# EAGLE board MEM_MUX_3 (EAGLE 6.5.0), part 1 of 2
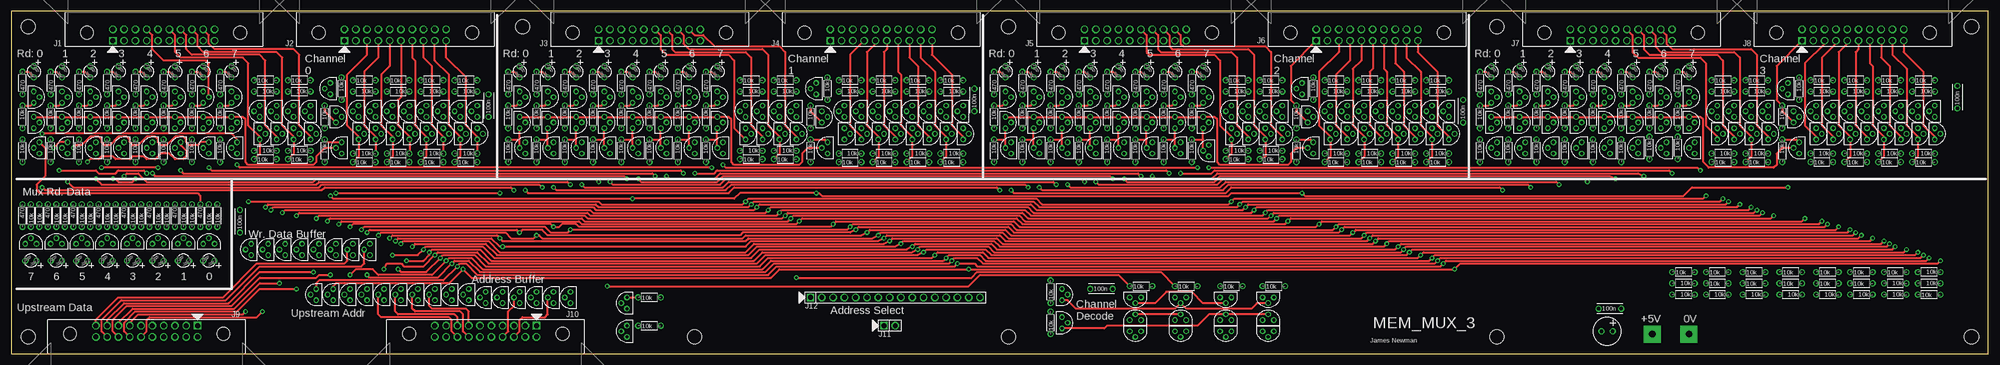
[diagram p18: board, top side]
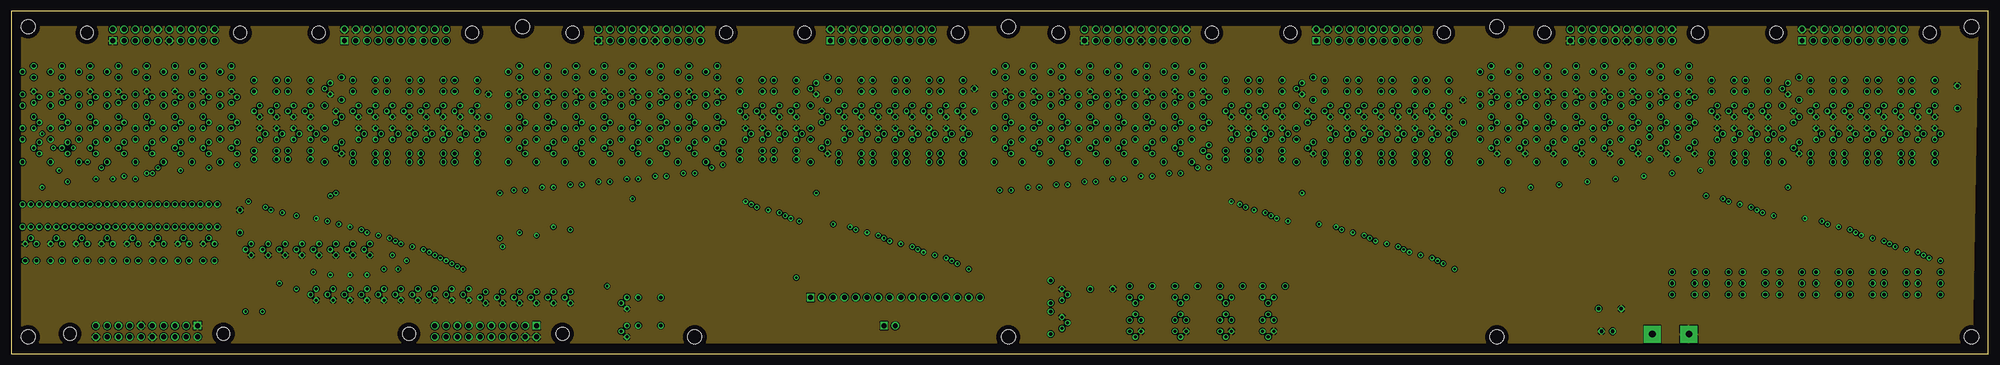
[diagram p19: board, inner layer Route2]
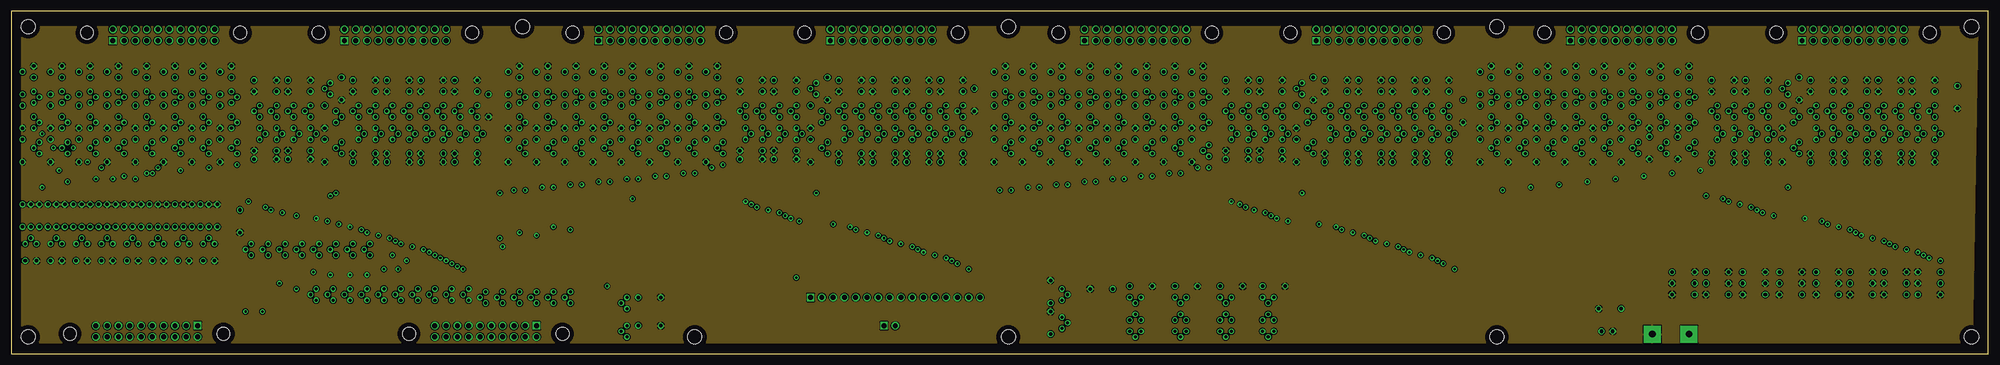
[diagram p20: board, inner layer Route3]
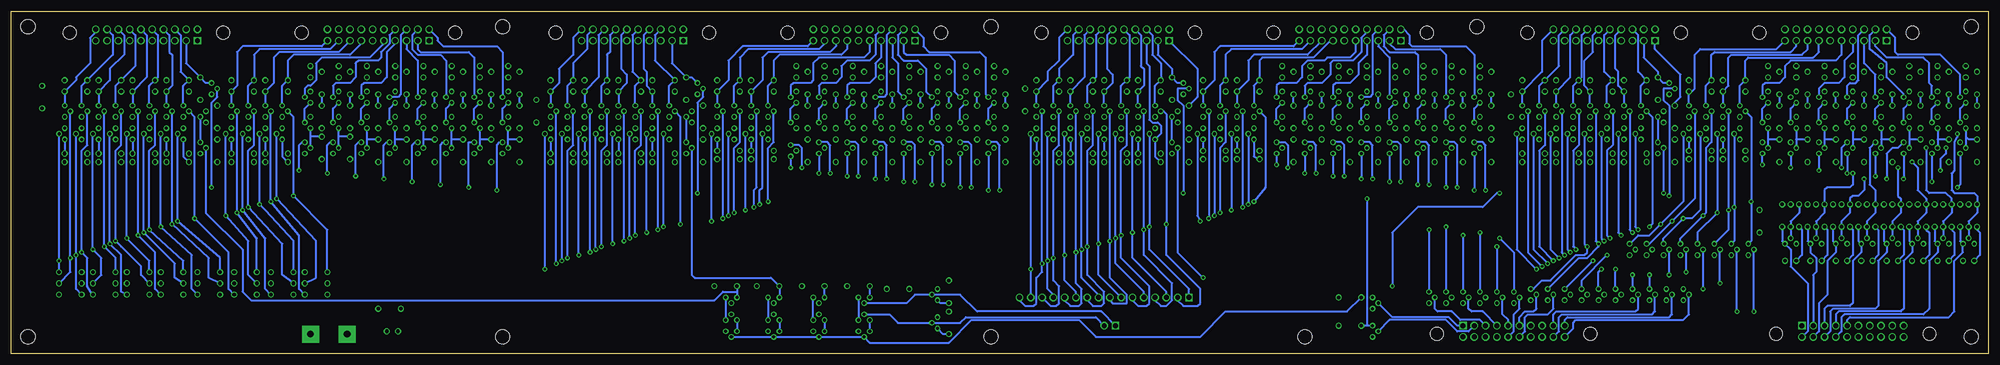
[diagram p21: board, bottom side, seen from below]

Size 444.48 x 77.14 mm. Coordinates in mm from the lower left corner, seen from the top.
Outline: 0,0 444.48,0 444.48,77.14 0,77.14 0,0
Copper layers (1*2+3*16): Top 0.035mm / dielectric 0.2mm / Route2 0.035mm / dielectric 1mm / Route3 0.035mm / dielectric 0.2mm / Bottom 0.035mm
Design rules "processor_rules_4layer": minimum track width 10mil, minimum drill 0.0236mm, track to track 8mil, track to pad 8mil, pad to pad 8mil, via to via 8mil, smd to smd 8mil, copper to edge 40mil, drill to drill 8mil, minimum pad ring 10mil, minimum via ring 8mil, stop-mask expansion 4mil, vias tented up to drill 0.7mm, thermal gap 10mil

## Footprints (pad centres in the part's own frame; a part is rotated, then mirrored left to right if it is on the bottom)
CAP_P2INCH = drill 0.8: 1 -2.54,0; 2 2.54,0
POLARISED_CAP_2P5_6P3MM = drill 0.8: A 1.27,0; K -1.27,0
LED3MM = drill 0.8: A -1.27,0; K 1.27,0
3M_HOLE = hole 3.2: 0,0
20_HDR_LOCKING_RA = drill 1.1 square: 1 -11.43,-1.27 | drill 1.1: 2 -11.43,1.27; 3 -8.89,-1.27; 4 -8.89,1.27; 5 -6.35,-1.27; 6 -6.35,1.27; 7 -3.81,-1.27; 8 -3.81,1.27; 9 -1.27,-1.27; 10 -1.27,1.27; 11 1.27,-1.27; 12 1.27,1.27; 13 3.81,-1.27; 14 3.81,1.27; 15 6.35,-1.27; 16 6.35,1.27; 17 8.89,-1.27; 18 8.89,1.27; 19 11.43,-1.27; 20 11.43,1.27 | hole 2.946: -17.247,0.533; 17.247,0.533
JUMP_2X1 = drill 1.1 square: 1 -1.27,0 | drill 1.1: 2 1.27,0
JUMP_16X1 = drill 1.1 square: 1 -19.05,0 | drill 1.1: 2 -16.51,0; 3 -13.97,0; 4 -11.43,0; 5 -8.89,0; 6 -6.35,0; 7 -3.81,0; 8 -1.27,0; 9 1.27,0; 10 3.81,0; 11 6.35,0; 12 8.89,0; 13 11.43,0; 14 13.97,0; 15 16.51,0; 16 19.05,0
TO92-DGS = drill 0.7: D 0,1.27; G -1.27,0; S 0,-1.27
R_P2INCH = drill 0.8: 1 -2.54,0; 2 2.54,0
POWER_PAD = drill 1.5 pad 3.81 square: 1 0,0

## Placement (x,y rotation side)
C1  100n  [CAP_P2INCH]  216.53,57.15 90 top
C2  100n  [CAP_P2INCH]  51.44,29.84 90 top
C3  100n  [CAP_P2INCH]  107.31,55.88 90 top
C4  100n  [CAP_P2INCH]  359.41,10.16 0 top
C5  100n  [CAP_P2INCH]  245.11,14.61 0 top
C6  100n  [CAP_P2INCH]  437.51,57.78 90 top
C7  100u  [POLARISED_CAP_2P5_6P3MM]  358.77,5.08 0 top
C8  100n  [CAP_P2INCH]  326.39,54.61 90 top
D1  L-1334SRT  [LED3MM]  5.08,63.5 270 top
D2  L-1334SRT  [LED3MM]  11.43,63.5 270 top
D3  L-1334SRT  [LED3MM]  17.78,63.5 270 top
D4  L-1334SRT  [LED3MM]  24.13,63.5 270 top
D5  L-1334SRT  [LED3MM]  30.48,63.5 270 top
D6  L-1334SRT  [LED3MM]  36.83,63.5 270 top
D7  L-1334SRT  [LED3MM]  43.18,63.5 270 top
D8  L-1334SRT  [LED3MM]  49.53,63.5 270 top
D9  L-1334SRT  [LED3MM]  114.3,63.5 270 top
D10  L-1334SRT  [LED3MM]  120.65,63.5 270 top
D11  L-1334SRT  [LED3MM]  127,63.5 270 top
D12  L-1334SRT  [LED3MM]  133.35,63.5 270 top
D13  L-1334SRT  [LED3MM]  139.7,63.5 270 top
D14  L-1334SRT  [LED3MM]  146.05,63.5 270 top
D15  L-1334SRT  [LED3MM]  152.4,63.5 270 top
D16  L-1334SRT  [LED3MM]  158.75,63.5 270 top
D17  L-1334SRT  [LED3MM]  223.52,63.5 270 top
D18  L-1334SRT  [LED3MM]  229.87,63.5 270 top
D19  L-1334SRT  [LED3MM]  236.22,63.5 270 top
D20  L-1334SRT  [LED3MM]  242.57,63.5 270 top
D21  L-1334SRT  [LED3MM]  248.92,63.5 270 top
D22  L-1334SRT  [LED3MM]  255.27,63.5 270 top
D23  L-1334SRT  [LED3MM]  261.62,63.5 270 top
D24  L-1334SRT  [LED3MM]  267.97,63.5 270 top
D25  L-1334SRT  [LED3MM]  332.74,63.5 270 top
D26  L-1334SRT  [LED3MM]  339.09,63.5 270 top
D27  L-1334SRT  [LED3MM]  345.44,63.5 270 top
D28  L-1334SRT  [LED3MM]  351.79,63.5 270 top
D29  L-1334SRT  [LED3MM]  358.14,63.5 270 top
D30  L-1334SRT  [LED3MM]  364.49,63.5 270 top
D31  L-1334SRT  [LED3MM]  370.84,63.5 270 top
D32  L-1334SRT  [LED3MM]  377.19,63.5 270 top
D33  L-1334SRT  [LED3MM]  38.73,20.95 180 top
D34  L-1334SRT  [LED3MM]  33.02,20.95 180 top
D35  L-1334SRT  [LED3MM]  27.3,20.95 180 top
D36  L-1334SRT  [LED3MM]  21.59,20.95 180 top
D37  L-1334SRT  [LED3MM]  15.88,20.95 180 top
D38  L-1334SRT  [LED3MM]  10.16,20.95 180 top
D39  L-1334SRT  [LED3MM]  4.45,20.95 180 top
D69  L-1334SRT  [LED3MM]  44.45,20.95 180 top
H1  3M_MOUNT_HOLE  [3M_HOLE]  440.69,3.81 0 top
H2  3M_MOUNT_HOLE  [3M_HOLE]  3.81,3.81 0 top
H3  3M_MOUNT_HOLE  [3M_HOLE]  3.81,73.66 0 top
H4  3M_MOUNT_HOLE  [3M_HOLE]  440.69,73.66 0 top
H5  3M_MOUNT_HOLE  [3M_HOLE]  114.94,73.66 0 top
H6  3M_MOUNT_HOLE  [3M_HOLE]  224.16,73.66 0 top
H7  3M_MOUNT_HOLE  [3M_HOLE]  334.01,73.66 0 top
H8  3M_MOUNT_HOLE  [3M_HOLE]  334.01,3.81 0 top
H9  3M_MOUNT_HOLE  [3M_HOLE]  224.16,3.81 0 top
H10  3M_MOUNT_HOLE  [3M_HOLE]  153.67,3.81 0 top
J1  20_HDR_LOCKING_RA  [20_HDR_LOCKING_RA]  34.29,71.75 0 top
J2  20_HDR_LOCKING_RA  [20_HDR_LOCKING_RA]  86.36,71.75 0 top
J3  20_HDR_LOCKING_RA  [20_HDR_LOCKING_RA]  143.51,71.75 0 top
J4  20_HDR_LOCKING_RA  [20_HDR_LOCKING_RA]  195.58,71.75 0 top
J5  20_HDR_LOCKING_RA  [20_HDR_LOCKING_RA]  252.73,71.75 0 top
J6  20_HDR_LOCKING_RA  [20_HDR_LOCKING_RA]  304.8,71.75 0 top
J7  20_HDR_LOCKING_RA  [20_HDR_LOCKING_RA]  361.95,71.75 0 top
J8  20_HDR_LOCKING_RA  [20_HDR_LOCKING_RA]  414.02,71.75 0 top
J9  20_HDR_LOCKING_RA  [20_HDR_LOCKING_RA]  30.48,5.08 180 top
J10  20_HDR_LOCKING_RA  [20_HDR_LOCKING_RA]  106.68,5.08 180 top
J11  JUMP_2X1  [JUMP_2X1]  197.49,6.35 0 top
J12  JUMP_16X1  [JUMP_16X1]  198.75,12.7 0 top
Q1  2N7000  [TO92-DGS]  5.08,57.78 180 top
Q2  2N7000  [TO92-DGS]  5.08,52.07 180 top
Q3  2N7000  [TO92-DGS]  11.43,57.78 180 top
Q4  2N7000  [TO92-DGS]  11.43,52.07 180 top
Q5  2N7000  [TO92-DGS]  17.78,57.78 180 top
Q6  2N7000  [TO92-DGS]  17.78,52.07 180 top
Q7  2N7000  [TO92-DGS]  24.13,57.78 180 top
Q8  2N7000  [TO92-DGS]  24.13,52.07 180 top
Q9  2N7000  [TO92-DGS]  30.48,57.78 180 top
Q10  2N7000  [TO92-DGS]  30.48,52.07 180 top
Q11  2N7000  [TO92-DGS]  36.83,57.78 180 top
Q12  2N7000  [TO92-DGS]  36.83,52.07 180 top
Q13  2N7000  [TO92-DGS]  43.18,57.78 180 top
Q14  2N7000  [TO92-DGS]  43.18,52.07 180 top
Q15  2N7000  [TO92-DGS]  49.53,57.78 180 top
Q16  2N7000  [TO92-DGS]  49.53,52.07 180 top
Q17  2N7000  [TO92-DGS]  78.11,49.53 180 top
Q18  2N7000  [TO92-DGS]  78.11,54.61 0 top
Q19  2N7000  [TO92-DGS]  81.92,49.53 180 top
Q20  2N7000  [TO92-DGS]  81.92,54.61 0 top
Q21  2N7000  [TO92-DGS]  85.72,49.53 180 top
Q22  2N7000  [TO92-DGS]  85.72,54.61 0 top
Q23  2N7000  [TO92-DGS]  73.03,53.34 180 top
Q24  2N7000  [TO92-DGS]  71.75,59.69 0 top
Q25  2N7000  [TO92-DGS]  55.88,49.53 180 top
Q26  2N7000  [TO92-DGS]  55.88,54.61 0 top
Q27  2N7000  [TO92-DGS]  59.69,49.53 180 top
Q28  2N7000  [TO92-DGS]  59.69,54.61 0 top
Q29  2N7000  [TO92-DGS]  63.5,49.53 180 top
Q30  2N7000  [TO92-DGS]  63.5,54.61 0 top
Q31  2N7000  [TO92-DGS]  67.31,49.53 180 top
Q32  2N7000  [TO92-DGS]  67.31,54.61 0 top
Q33  2N7000  [TO92-DGS]  89.53,49.53 180 top
Q34  2N7000  [TO92-DGS]  89.53,54.61 0 top
Q35  2N7000  [TO92-DGS]  93.34,49.53 180 top
Q36  2N7000  [TO92-DGS]  93.34,54.61 0 top
Q37  2N7000  [TO92-DGS]  97.16,49.53 180 top
Q38  2N7000  [TO92-DGS]  97.16,54.61 0 top
Q39  2N7000  [TO92-DGS]  100.97,49.53 180 top
Q40  2N7000  [TO92-DGS]  100.97,54.61 0 top
Q41  2N7000  [TO92-DGS]  104.78,49.53 180 top
Q42  2N7000  [TO92-DGS]  104.78,54.61 0 top
Q43  2N7000  [TO92-DGS]  114.3,57.78 180 top
Q44  2N7000  [TO92-DGS]  114.3,52.07 180 top
Q45  2N7000  [TO92-DGS]  120.65,57.78 180 top
Q46  2N7000  [TO92-DGS]  120.65,52.07 180 top
Q47  2N7000  [TO92-DGS]  127,57.78 180 top
Q48  2N7000  [TO92-DGS]  127,52.07 180 top
Q49  2N7000  [TO92-DGS]  133.35,57.78 180 top
Q50  2N7000  [TO92-DGS]  133.35,52.07 180 top
Q51  2N7000  [TO92-DGS]  139.7,57.78 180 top
Q52  2N7000  [TO92-DGS]  139.7,52.07 180 top
Q53  2N7000  [TO92-DGS]  146.05,57.78 180 top
Q54  2N7000  [TO92-DGS]  146.05,52.07 180 top
Q55  2N7000  [TO92-DGS]  152.4,57.78 180 top
Q56  2N7000  [TO92-DGS]  152.4,52.07 180 top
Q57  2N7000  [TO92-DGS]  158.75,57.78 180 top
Q58  2N7000  [TO92-DGS]  158.75,52.07 180 top
Q59  2N7000  [TO92-DGS]  182.25,53.34 180 top
Q60  2N7000  [TO92-DGS]  180.97,59.69 0 top
Q61  2N7000  [TO92-DGS]  165.1,49.53 180 top
Q62  2N7000  [TO92-DGS]  165.1,54.61 0 top
Q63  2N7000  [TO92-DGS]  168.91,49.53 180 top
Q64  2N7000  [TO92-DGS]  168.91,54.61 0 top
Q65  2N7000  [TO92-DGS]  172.72,49.53 180 top
Q66  2N7000  [TO92-DGS]  172.72,54.61 0 top
Q67  2N7000  [TO92-DGS]  176.53,49.53 180 top
Q68  2N7000  [TO92-DGS]  176.53,54.61 0 top
Q69  2N7000  [TO92-DGS]  187.32,49.53 180 top
Q70  2N7000  [TO92-DGS]  187.32,54.61 0 top
Q71  2N7000  [TO92-DGS]  191.13,49.53 180 top
Q72  2N7000  [TO92-DGS]  191.13,54.61 0 top
Q73  2N7000  [TO92-DGS]  194.94,49.53 180 top
Q74  2N7000  [TO92-DGS]  194.94,54.61 0 top
Q75  2N7000  [TO92-DGS]  198.75,49.53 180 top
Q76  2N7000  [TO92-DGS]  198.75,54.61 0 top
Q77  2N7000  [TO92-DGS]  202.56,49.53 180 top
Q78  2N7000  [TO92-DGS]  202.56,54.61 0 top
Q79  2N7000  [TO92-DGS]  206.38,49.53 180 top
Q80  2N7000  [TO92-DGS]  206.38,54.61 0 top
Q81  2N7000  [TO92-DGS]  210.19,49.53 180 top
Q82  2N7000  [TO92-DGS]  210.19,54.61 0 top
Q83  2N7000  [TO92-DGS]  214,49.53 180 top
Q84  2N7000  [TO92-DGS]  214,54.61 0 top
Q85  2N7000  [TO92-DGS]  223.52,57.78 180 top
Q86  2N7000  [TO92-DGS]  223.52,52.07 180 top
Q87  2N7000  [TO92-DGS]  229.87,57.78 180 top
Q88  2N7000  [TO92-DGS]  229.87,52.07 180 top
Q89  2N7000  [TO92-DGS]  236.22,57.78 180 top
Q90  2N7000  [TO92-DGS]  236.22,52.07 180 top
Q91  2N7000  [TO92-DGS]  242.57,57.78 180 top
Q92  2N7000  [TO92-DGS]  242.57,52.07 180 top
Q93  2N7000  [TO92-DGS]  248.92,57.78 180 top
Q94  2N7000  [TO92-DGS]  248.92,52.07 180 top
Q95  2N7000  [TO92-DGS]  255.27,57.78 180 top
Q96  2N7000  [TO92-DGS]  255.27,52.07 180 top
Q97  2N7000  [TO92-DGS]  261.62,57.78 180 top
Q98  2N7000  [TO92-DGS]  261.62,52.07 180 top
Q99  2N7000  [TO92-DGS]  267.97,57.78 180 top
Q100  2N7000  [TO92-DGS]  267.97,52.07 180 top
Q101  2N7000  [TO92-DGS]  291.46,53.34 180 top
Q102  2N7000  [TO92-DGS]  290.19,59.69 0 top
Q103  2N7000  [TO92-DGS]  274.32,49.53 180 top
Q104  2N7000  [TO92-DGS]  274.32,54.61 0 top
Q105  2N7000  [TO92-DGS]  278.13,49.53 180 top
Q106  2N7000  [TO92-DGS]  278.13,54.61 0 top
Q107  2N7000  [TO92-DGS]  281.94,49.53 180 top
Q108  2N7000  [TO92-DGS]  281.94,54.61 0 top
Q109  2N7000  [TO92-DGS]  285.75,49.53 180 top
Q110  2N7000  [TO92-DGS]  285.75,54.61 0 top
Q111  2N7000  [TO92-DGS]  296.55,49.53 180 top
Q112  2N7000  [TO92-DGS]  296.55,54.61 0 top
Q113  2N7000  [TO92-DGS]  300.36,49.53 180 top
Q114  2N7000  [TO92-DGS]  300.36,54.61 0 top
Q115  2N7000  [TO92-DGS]  304.17,49.53 180 top
Q116  2N7000  [TO92-DGS]  304.17,54.61 0 top
Q117  2N7000  [TO92-DGS]  307.98,49.53 180 top
Q118  2N7000  [TO92-DGS]  307.98,54.61 0 top
Q119  2N7000  [TO92-DGS]  311.79,49.53 180 top
Q120  2N7000  [TO92-DGS]  311.79,54.61 0 top
Q121  2N7000  [TO92-DGS]  315.6,49.53 180 top
Q122  2N7000  [TO92-DGS]  315.6,54.61 0 top
Q123  2N7000  [TO92-DGS]  319.4,49.53 180 top
Q124  2N7000  [TO92-DGS]  319.4,54.61 0 top
Q125  2N7000  [TO92-DGS]  323.21,49.53 180 top
Q126  2N7000  [TO92-DGS]  323.21,54.61 0 top
Q127  2N7000  [TO92-DGS]  332.74,57.78 180 top
Q128  2N7000  [TO92-DGS]  332.74,52.07 180 top
Q129  2N7000  [TO92-DGS]  339.09,57.78 180 top
Q130  2N7000  [TO92-DGS]  339.09,52.07 180 top
Q131  2N7000  [TO92-DGS]  345.44,57.78 180 top
Q132  2N7000  [TO92-DGS]  345.44,52.07 180 top
Q133  2N7000  [TO92-DGS]  351.79,57.78 180 top
Q134  2N7000  [TO92-DGS]  351.79,52.07 180 top
Q135  2N7000  [TO92-DGS]  358.14,57.78 180 top
Q136  2N7000  [TO92-DGS]  358.14,52.07 180 top
Q137  2N7000  [TO92-DGS]  364.49,57.78 180 top
Q138  2N7000  [TO92-DGS]  364.49,52.07 180 top
Q139  2N7000  [TO92-DGS]  370.84,57.78 180 top
Q140  2N7000  [TO92-DGS]  370.84,52.07 180 top
Q141  2N7000  [TO92-DGS]  377.19,57.78 180 top
Q142  2N7000  [TO92-DGS]  377.19,52.07 180 top
Q143  2N7000  [TO92-DGS]  400.69,53.34 180 top
Q144  2N7000  [TO92-DGS]  399.42,59.69 0 top
Q145  2N7000  [TO92-DGS]  383.54,49.53 180 top
Q146  2N7000  [TO92-DGS]  383.54,54.61 0 top
Q147  2N7000  [TO92-DGS]  387.35,49.53 180 top
Q148  2N7000  [TO92-DGS]  387.35,54.61 0 top
Q149  2N7000  [TO92-DGS]  391.16,49.53 180 top
Q150  2N7000  [TO92-DGS]  391.16,54.61 0 top
Q151  2N7000  [TO92-DGS]  394.97,49.53 180 top
Q152  2N7000  [TO92-DGS]  394.97,54.61 0 top
Q153  2N7000  [TO92-DGS]  405.76,49.53 180 top
Q154  2N7000  [TO92-DGS]  405.76,54.61 0 top
Q155  2N7000  [TO92-DGS]  409.57,49.53 180 top
Q156  2N7000  [TO92-DGS]  409.57,54.61 0 top
Q157  2N7000  [TO92-DGS]  413.38,49.53 180 top
Q158  2N7000  [TO92-DGS]  413.38,54.61 0 top
Q159  2N7000  [TO92-DGS]  417.19,49.53 180 top
Q160  2N7000  [TO92-DGS]  417.19,54.61 0 top
Q161  2N7000  [TO92-DGS]  421,49.53 180 top
Q162  2N7000  [TO92-DGS]  421,54.61 0 top
Q163  2N7000  [TO92-DGS]  424.81,49.53 180 top
Q164  2N7000  [TO92-DGS]  424.81,54.61 0 top
Q165  2N7000  [TO92-DGS]  428.62,49.53 180 top
Q166  2N7000  [TO92-DGS]  428.62,54.61 0 top
Q167  2N7000  [TO92-DGS]  432.44,49.53 180 top
Q168  2N7000  [TO92-DGS]  432.44,54.61 0 top
Q169  2N7000  [TO92-DGS]  6.35,46.35 0 top
Q170  2N7000  [TO92-DGS]  44.45,24.77 270 top
Q171  2N7000  [TO92-DGS]  115.57,46.35 0 top
Q172  2N7000  [TO92-DGS]  224.79,46.35 0 top
Q173  2N7000  [TO92-DGS]  334.01,46.35 0 top
Q174  2N7000  [TO92-DGS]  12.7,46.35 0 top
Q175  2N7000  [TO92-DGS]  38.73,24.77 270 top
Q176  2N7000  [TO92-DGS]  121.92,46.35 0 top
Q177  2N7000  [TO92-DGS]  231.14,46.35 0 top
Q178  2N7000  [TO92-DGS]  340.36,46.35 0 top
Q179  2N7000  [TO92-DGS]  19.05,46.35 0 top
Q180  2N7000  [TO92-DGS]  33.02,24.77 270 top
Q181  2N7000  [TO92-DGS]  128.27,46.35 0 top
Q182  2N7000  [TO92-DGS]  237.49,46.35 0 top
Q183  2N7000  [TO92-DGS]  346.71,46.35 0 top
Q184  2N7000  [TO92-DGS]  25.4,46.35 0 top
Q185  2N7000  [TO92-DGS]  27.3,24.77 270 top
Q186  2N7000  [TO92-DGS]  134.62,46.35 0 top
Q187  2N7000  [TO92-DGS]  243.84,46.35 0 top
Q188  2N7000  [TO92-DGS]  353.06,46.35 0 top
Q189  2N7000  [TO92-DGS]  31.75,46.35 0 top
Q190  2N7000  [TO92-DGS]  21.59,24.77 270 top
Q191  2N7000  [TO92-DGS]  140.97,46.35 0 top
Q192  2N7000  [TO92-DGS]  250.19,46.35 0 top
Q193  2N7000  [TO92-DGS]  359.41,46.35 0 top
Q194  2N7000  [TO92-DGS]  38.1,46.35 0 top
Q195  2N7000  [TO92-DGS]  15.88,24.77 270 top
Q196  2N7000  [TO92-DGS]  147.32,46.35 0 top
Q197  2N7000  [TO92-DGS]  256.54,46.35 0 top
Q198  2N7000  [TO92-DGS]  365.76,46.35 0 top
Q199  2N7000  [TO92-DGS]  44.45,46.35 0 top
Q200  2N7000  [TO92-DGS]  10.16,24.77 270 top
Q201  2N7000  [TO92-DGS]  153.67,46.35 0 top
Q202  2N7000  [TO92-DGS]  262.89,46.35 0 top
Q203  2N7000  [TO92-DGS]  372.11,46.35 0 top
Q204  2N7000  [TO92-DGS]  50.8,46.35 0 top
Q205  2N7000  [TO92-DGS]  4.45,24.77 270 top
Q206  2N7000  [TO92-DGS]  160.02,46.35 0 top
Q207  2N7000  [TO92-DGS]  269.24,45.72 0 top
Q208  2N7000  [TO92-DGS]  378.46,46.35 0 top
Q209  2N7000  [TO92-DGS]  57.78,23.5 0 top
Q210  2N7000  [TO92-DGS]  53.98,23.5 0 top
Q211  2N7000  [TO92-DGS]  65.41,23.5 0 top
Q212  2N7000  [TO92-DGS]  61.59,23.5 0 top
Q213  2N7000  [TO92-DGS]  73.03,23.5 0 top
Q214  2N7000  [TO92-DGS]  69.22,23.5 0 top
Q215  2N7000  [TO92-DGS]  80.64,23.5 0 top
Q216  2N7000  [TO92-DGS]  76.83,23.5 0 top
Q217  2N7000  [TO92-DGS]  125.73,12.7 0 top
Q218  2N7000  [TO92-DGS]  121.92,12.7 0 top
Q219  2N7000  [TO92-DGS]  118.11,12.7 0 top
Q220  2N7000  [TO92-DGS]  114.3,12.7 0 top
Q221  2N7000  [TO92-DGS]  110.49,12.7 0 top
Q222  2N7000  [TO92-DGS]  106.68,12.7 0 top
Q223  2N7000  [TO92-DGS]  102.87,13.34 0 top
Q224  2N7000  [TO92-DGS]  99.06,13.34 0 top
Q225  2N7000  [TO92-DGS]  95.25,13.34 0 top
Q226  2N7000  [TO92-DGS]  91.44,13.34 0 top
Q227  2N7000  [TO92-DGS]  87.63,13.34 0 top
Q228  2N7000  [TO92-DGS]  83.82,13.34 0 top
Q229  2N7000  [TO92-DGS]  80.01,13.34 0 top
Q230  2N7000  [TO92-DGS]  76.2,13.34 0 top
Q231  2N7000  [TO92-DGS]  72.39,13.34 0 top
Q232  2N7000  [TO92-DGS]  68.58,13.34 0 top
Q233  2N7000  [TO92-DGS]  236.22,13.34 180 top
Q234  2N7000  [TO92-DGS]  236.22,6.99 180 top
Q235  2N7000  [TO92-DGS]  138.43,11.43 0 top
Q236  2N7000  [TO92-DGS]  138.43,5.08 0 top
Q237  2N7000  [TO92-DGS]  252.73,12.7 90 top
Q238  2N7000  [TO92-DGS]  252.73,7.62 270 top
Q239  2N7000  [TO92-DGS]  252.73,5.08 90 top
Q240  2N7000  [TO92-DGS]  74.3,46.35 0 top
Q241  2N7000  [TO92-DGS]  262.89,12.7 90 top
Q242  2N7000  [TO92-DGS]  262.89,7.62 270 top
Q243  2N7000  [TO92-DGS]  262.89,5.08 90 top
Q244  2N7000  [TO92-DGS]  183.51,46.35 0 top
Q245  2N7000  [TO92-DGS]  273.05,12.7 90 top
Q246  2N7000  [TO92-DGS]  273.05,7.62 270 top
Q247  2N7000  [TO92-DGS]  273.05,5.08 90 top
Q248  2N7000  [TO92-DGS]  292.74,46.35 0 top
Q249  2N7000  [TO92-DGS]  282.57,12.7 90 top
Q250  2N7000  [TO92-DGS]  282.57,7.62 270 top
Q251  2N7000  [TO92-DGS]  282.57,5.08 90 top
Q252  2N7000  [TO92-DGS]  401.95,46.35 0 top
R1  10k  [R_P2INCH]  2.54,53.34 270 top
R2  470  [R_P2INCH]  2.54,60.96 90 top
R3  10k  [R_P2INCH]  8.89,53.34 270 top
R4  470  [R_P2INCH]  8.89,60.96 90 top
R5  10k  [R_P2INCH]  15.24,53.34 270 top
R6  470  [R_P2INCH]  15.24,60.96 90 top
R7  10k  [R_P2INCH]  21.59,53.34 270 top
R8  470  [R_P2INCH]  21.59,60.96 90 top
R9  10k  [R_P2INCH]  27.94,53.34 270 top
R10  470  [R_P2INCH]  27.94,60.96 90 top
R11  10k  [R_P2INCH]  34.29,53.34 270 top
R12  470  [R_P2INCH]  34.29,60.96 90 top
R13  10k  [R_P2INCH]  40.64,53.34 270 top
R14  470  [R_P2INCH]  40.64,60.96 90 top
R15  10k  [R_P2INCH]  46.99,53.34 270 top
R16  470  [R_P2INCH]  46.99,60.96 90 top
R17  10k  [R_P2INCH]  2.54,45.72 270 top
R18  10k  [R_P2INCH]  8.89,45.72 270 top
R19  10k  [R_P2INCH]  15.24,45.72 270 top
R20  10k  [R_P2INCH]  21.59,45.72 270 top
R21  10k  [R_P2INCH]  27.94,45.72 270 top
R22  10k  [R_P2INCH]  34.29,45.72 270 top
R23  10k  [R_P2INCH]  40.64,45.72 270 top
R24  10k  [R_P2INCH]  46.99,45.72 270 top
R25  10k  [R_P2INCH]  79.38,43.18 0 top
R26  10k  [R_P2INCH]  79.38,61.59 0 top
R27  10k  [R_P2INCH]  79.38,45.09 180 top
R28  10k  [R_P2INCH]  79.38,59.05 180 top
R29  10k  [R_P2INCH]  87,43.18 0 top
R30  10k  [R_P2INCH]  87,61.59 0 top
R31  10k  [R_P2INCH]  70.48,53.34 270 top
R32  10k  [R_P2INCH]  74.3,59.69 270 top
R33  10k  [R_P2INCH]  57.15,43.81 0 top
R34  10k  [R_P2INCH]  57.15,61.59 0 top
R35  10k  [R_P2INCH]  57.15,45.72 180 top
R36  10k  [R_P2INCH]  57.15,59.05 180 top
R37  10k  [R_P2INCH]  64.77,43.81 0 top
R38  10k  [R_P2INCH]  64.77,61.59 0 top
R39  10k  [R_P2INCH]  64.77,45.72 180 top
R40  10k  [R_P2INCH]  64.77,59.05 180 top
R41  10k  [R_P2INCH]  87,45.09 180 top
R42  10k  [R_P2INCH]  87,59.05 180 top
R43  10k  [R_P2INCH]  94.61,43.18 0 top
R44  10k  [R_P2INCH]  94.61,61.59 0 top
R45  10k  [R_P2INCH]  94.61,45.09 180 top
R46  10k  [R_P2INCH]  94.61,59.05 180 top
R47  10k  [R_P2INCH]  102.23,43.18 0 top
R48  10k  [R_P2INCH]  102.23,61.59 0 top
R49  10k  [R_P2INCH]  102.23,45.09 180 top
R50  10k  [R_P2INCH]  102.23,59.05 180 top
R51  10k  [R_P2INCH]  111.76,53.34 270 top
R52  470  [R_P2INCH]  111.76,60.96 90 top
R53  10k  [R_P2INCH]  118.11,53.34 270 top
R54  470  [R_P2INCH]  118.11,60.96 90 top
R55  10k  [R_P2INCH]  124.46,53.34 270 top
R56  470  [R_P2INCH]  124.46,60.96 90 top
R57  10k  [R_P2INCH]  130.81,53.34 270 top
R58  470  [R_P2INCH]  130.81,60.96 90 top
R59  10k  [R_P2INCH]  137.16,53.34 270 top
R60  470  [R_P2INCH]  137.16,60.96 90 top
R61  10k  [R_P2INCH]  143.51,53.34 270 top
R62  470  [R_P2INCH]  143.51,60.96 90 top
R63  10k  [R_P2INCH]  149.86,53.34 270 top
R64  470  [R_P2INCH]  149.86,60.96 90 top
R65  10k  [R_P2INCH]  156.21,53.34 270 top
R66  470  [R_P2INCH]  156.21,60.96 90 top
R67  10k  [R_P2INCH]  111.76,45.72 270 top
R68  10k  [R_P2INCH]  118.11,45.72 270 top
R69  10k  [R_P2INCH]  124.46,45.72 270 top
R70  10k  [R_P2INCH]  130.81,45.72 270 top
R71  10k  [R_P2INCH]  137.16,45.72 270 top
R72  10k  [R_P2INCH]  143.51,45.72 270 top
R73  10k  [R_P2INCH]  149.86,45.72 270 top
R74  10k  [R_P2INCH]  156.21,45.72 270 top
R75  10k  [R_P2INCH]  179.71,53.34 270 top
R76  10k  [R_P2INCH]  183.51,59.69 270 top
R77  10k  [R_P2INCH]  166.37,43.81 0 top
R78  10k  [R_P2INCH]  166.37,61.59 0 top
R79  10k  [R_P2INCH]  166.37,45.72 180 top
R80  10k  [R_P2INCH]  166.37,59.05 180 top
R81  10k  [R_P2INCH]  173.99,43.81 0 top
R82  10k  [R_P2INCH]  173.99,61.59 0 top
R83  10k  [R_P2INCH]  173.99,45.72 180 top
R84  10k  [R_P2INCH]  173.99,59.05 180 top
R85  10k  [R_P2INCH]  188.59,43.18 0 top
R86  10k  [R_P2INCH]  188.59,61.59 0 top
R87  10k  [R_P2INCH]  188.59,45.09 180 top
R88  10k  [R_P2INCH]  188.59,59.05 180 top
R89  10k  [R_P2INCH]  196.22,43.18 0 top
R90  10k  [R_P2INCH]  196.22,61.59 0 top
R91  10k  [R_P2INCH]  196.22,45.09 180 top
R92  10k  [R_P2INCH]  196.22,59.05 180 top
R93  10k  [R_P2INCH]  203.84,43.18 0 top
R94  10k  [R_P2INCH]  203.84,61.59 0 top
R95  10k  [R_P2INCH]  203.84,45.09 180 top
R96  10k  [R_P2INCH]  203.84,59.05 180 top
R97  10k  [R_P2INCH]  211.46,43.18 0 top
R98  10k  [R_P2INCH]  211.46,61.59 0 top
R99  10k  [R_P2INCH]  211.46,45.09 180 top
R100  10k  [R_P2INCH]  211.46,59.05 180 top
R101  10k  [R_P2INCH]  220.98,53.34 270 top
R102  470  [R_P2INCH]  220.98,60.96 90 top
R103  10k  [R_P2INCH]  227.33,53.34 270 top
R104  470  [R_P2INCH]  227.33,60.96 90 top
R105  10k  [R_P2INCH]  233.68,53.34 270 top
R106  470  [R_P2INCH]  233.68,60.96 90 top
R107  10k  [R_P2INCH]  240.03,53.34 270 top
R108  470  [R_P2INCH]  240.03,60.96 90 top
R109  10k  [R_P2INCH]  246.38,53.34 270 top
R110  470  [R_P2INCH]  246.38,60.96 90 top
R111  10k  [R_P2INCH]  252.73,53.34 270 top
R112  470  [R_P2INCH]  252.73,60.96 90 top
R113  10k  [R_P2INCH]  259.08,53.34 270 top
R114  470  [R_P2INCH]  259.08,60.96 90 top
R115  10k  [R_P2INCH]  265.43,53.34 270 top
R116  470  [R_P2INCH]  265.43,60.96 90 top
R117  10k  [R_P2INCH]  220.98,45.72 270 top
R118  10k  [R_P2INCH]  227.33,45.72 270 top
R119  10k  [R_P2INCH]  233.68,45.72 270 top
R120  10k  [R_P2INCH]  240.03,45.72 270 top
R121  10k  [R_P2INCH]  246.38,45.72 270 top
R122  10k  [R_P2INCH]  252.73,45.72 270 top
R123  10k  [R_P2INCH]  259.08,45.72 270 top
R124  10k  [R_P2INCH]  265.43,45.72 270 top
R125  10k  [R_P2INCH]  288.93,53.34 270 top
R126  10k  [R_P2INCH]  292.74,59.69 270 top
R127  10k  [R_P2INCH]  275.59,43.81 0 top
R128  10k  [R_P2INCH]  275.59,61.59 0 top
R129  10k  [R_P2INCH]  275.59,45.72 180 top
R130  10k  [R_P2INCH]  275.59,59.05 180 top
R131  10k  [R_P2INCH]  283.21,43.81 0 top
R132  10k  [R_P2INCH]  283.21,61.59 0 top
R133  10k  [R_P2INCH]  283.21,45.72 180 top
R134  10k  [R_P2INCH]  283.21,59.05 180 top
R135  10k  [R_P2INCH]  297.81,43.18 0 top
R136  10k  [R_P2INCH]  297.81,61.59 0 top
R137  10k  [R_P2INCH]  297.81,45.09 180 top
R138  10k  [R_P2INCH]  297.81,59.05 180 top
R139  10k  [R_P2INCH]  305.44,43.18 0 top
R140  10k  [R_P2INCH]  305.44,61.59 0 top
R141  10k  [R_P2INCH]  305.44,45.09 180 top
R142  10k  [R_P2INCH]  305.44,59.05 180 top
R143  10k  [R_P2INCH]  313.06,43.18 0 top
R144  10k  [R_P2INCH]  313.06,61.59 0 top
R145  10k  [R_P2INCH]  313.06,45.09 180 top
R146  10k  [R_P2INCH]  313.06,59.05 180 top
R147  10k  [R_P2INCH]  320.68,43.18 0 top
R148  10k  [R_P2INCH]  320.68,61.59 0 top
R149  10k  [R_P2INCH]  320.68,45.09 180 top
R150  10k  [R_P2INCH]  320.68,59.05 180 top
R151  10k  [R_P2INCH]  330.2,53.34 270 top
R152  470  [R_P2INCH]  330.2,60.96 90 top
R153  10k  [R_P2INCH]  336.55,53.34 270 top
R154  470  [R_P2INCH]  336.55,60.96 90 top
R155  10k  [R_P2INCH]  342.9,53.34 270 top
R156  470  [R_P2INCH]  342.9,60.96 90 top
R157  10k  [R_P2INCH]  349.25,53.34 270 top
R158  470  [R_P2INCH]  349.25,60.96 90 top
R159  10k  [R_P2INCH]  355.6,53.34 270 top
R160  470  [R_P2INCH]  355.6,60.96 90 top
R161  10k  [R_P2INCH]  361.95,53.34 270 top
R162  470  [R_P2INCH]  361.95,60.96 90 top
R163  10k  [R_P2INCH]  368.3,53.34 270 top
R164  470  [R_P2INCH]  368.3,60.96 90 top
R165  10k  [R_P2INCH]  374.65,53.34 270 top
R166  470  [R_P2INCH]  374.65,60.96 90 top
R167  10k  [R_P2INCH]  330.2,45.72 270 top
R168  10k  [R_P2INCH]  336.55,45.72 270 top
R169  10k  [R_P2INCH]  342.9,45.72 270 top
R170  10k  [R_P2INCH]  349.25,45.72 270 top
R171  10k  [R_P2INCH]  355.6,45.72 270 top
R172  10k  [R_P2INCH]  361.95,45.72 270 top
R173  10k  [R_P2INCH]  368.3,46.35 270 top
R174  10k  [R_P2INCH]  374.65,46.35 270 top
R175  10k  [R_P2INCH]  398.14,53.34 270 top
R176  10k  [R_P2INCH]  401.95,59.69 270 top
R177  10k  [R_P2INCH]  384.81,43.18 0 top
R178  10k  [R_P2INCH]  384.81,61.59 0 top
R179  10k  [R_P2INCH]  384.81,45.09 180 top
R180  10k  [R_P2INCH]  384.81,59.05 180 top
R181  10k  [R_P2INCH]  392.43,43.18 0 top
R182  10k  [R_P2INCH]  392.43,61.59 0 top
R183  10k  [R_P2INCH]  392.43,45.09 180 top
R184  10k  [R_P2INCH]  392.43,59.05 180 top
R185  10k  [R_P2INCH]  407.04,43.18 0 top
R186  10k  [R_P2INCH]  407.04,61.59 0 top
R187  10k  [R_P2INCH]  407.04,45.09 180 top
R188  10k  [R_P2INCH]  407.04,59.05 180 top
R189  10k  [R_P2INCH]  414.65,43.18 0 top
R190  10k  [R_P2INCH]  414.65,61.59 0 top
R191  10k  [R_P2INCH]  414.65,45.09 180 top
R192  10k  [R_P2INCH]  414.65,59.05 180 top
R193  10k  [R_P2INCH]  422.27,43.18 0 top
R194  10k  [R_P2INCH]  422.27,61.59 0 top
R195  10k  [R_P2INCH]  422.27,45.09 180 top
R196  10k  [R_P2INCH]  422.27,59.05 180 top
R197  10k  [R_P2INCH]  429.89,43.18 0 top
R198  10k  [R_P2INCH]  429.89,61.59 0 top
R199  10k  [R_P2INCH]  429.89,45.09 180 top
R200  10k  [R_P2INCH]  429.89,59.05 180 top
R201  10k  [R_P2INCH]  44.45,31.11 90 top
R202  470  [R_P2INCH]  42.55,31.11 270 top
R203  10k  [R_P2INCH]  38.73,31.11 90 top
R204  470  [R_P2INCH]  36.83,31.11 270 top
R205  10k  [R_P2INCH]  33.02,31.11 90 top
R206  470  [R_P2INCH]  31.11,31.11 270 top
R207  10k  [R_P2INCH]  27.3,31.11 90 top
R208  470  [R_P2INCH]  25.4,31.11 270 top
R209  10k  [R_P2INCH]  21.59,31.11 90 top
R210  470  [R_P2INCH]  19.68,31.11 270 top
R211  10k  [R_P2INCH]  15.88,31.11 90 top
R212  470  [R_P2INCH]  13.97,31.11 270 top
R213  10k  [R_P2INCH]  10.16,31.11 90 top
R214  470  [R_P2INCH]  8.26,31.11 270 top
R215  10k  [R_P2INCH]  4.45,31.11 90 top
R216  470  [R_P2INCH]  2.54,31.11 270 top
R217  10k  [R_P2INCH]  375.92,15.88 180 top
R218  10k  [R_P2INCH]  375.92,18.41 0 top
R219  10k  [R_P2INCH]  383.54,18.41 0 top
R220  10k  [R_P2INCH]  375.92,13.34 180 top
R221  10k  [R_P2INCH]  383.54,13.34 180 top
R222  10k  [R_P2INCH]  383.54,15.88 0 top
R223  10k  [R_P2INCH]  391.8,15.88 0 top
R224  10k  [R_P2INCH]  391.8,18.41 0 top
R225  10k  [R_P2INCH]  400.05,18.41 0 top
R226  10k  [R_P2INCH]  391.8,13.34 180 top
R227  10k  [R_P2INCH]  400.05,13.34 180 top
R228  10k  [R_P2INCH]  400.05,15.88 0 top
R229  10k  [R_P2INCH]  408.31,15.88 0 top
R230  10k  [R_P2INCH]  408.31,18.41 0 top
R231  10k  [R_P2INCH]  415.93,18.41 0 top
R232  10k  [R_P2INCH]  408.31,13.34 180 top
R233  10k  [R_P2INCH]  415.93,13.34 180 top
R234  10k  [R_P2INCH]  415.93,15.88 0 top
R235  10k  [R_P2INCH]  423.55,15.88 180 top
R236  10k  [R_P2INCH]  423.55,18.41 0 top
R237  10k  [R_P2INCH]  431.17,13.34 0 top
R238  10k  [R_P2INCH]  423.55,13.34 180 top
R239  10k  [R_P2INCH]  431.17,18.41 180 top
R240  10k  [R_P2INCH]  431.17,15.88 180 top
R241  10k  [R_P2INCH]  233.68,13.97 90 top
R242  10k  [R_P2INCH]  233.68,6.99 90 top
R243  10k  [R_P2INCH]  143.51,12.7 0 top
R244  10k  [R_P2INCH]  143.51,6.35 0 top
R245  10k  [R_P2INCH]  254,15.24 0 top
R246  10k  [R_P2INCH]  70.48,45.72 270 top
R247  10k  [R_P2INCH]  264.16,15.24 0 top
R248  10k  [R_P2INCH]  179.71,45.72 270 top
R249  10k  [R_P2INCH]  274.32,15.24 0 top
R250  10k  [R_P2INCH]  288.93,45.72 270 top
R251  10k  [R_P2INCH]  283.85,15.24 0 top
R252  10k  [R_P2INCH]  398.14,45.72 270 top
R253  10k  [R_P2INCH]  23.5,31.11 90 top
R254  10k  [R_P2INCH]  17.78,31.11 90 top
R255  10k  [R_P2INCH]  12.06,31.11 90 top
R256  10k  [R_P2INCH]  6.35,31.11 90 top
R257  10k  [R_P2INCH]  46.35,31.11 90 top
R258  10k  [R_P2INCH]  40.64,31.11 90 top
R259  10k  [R_P2INCH]  34.92,31.11 90 top
R260  10k  [R_P2INCH]  29.21,31.11 90 top
TP5  POWER_PAD  [POWER_PAD]  368.94,4.45 0 top
TP6  POWER_PAD  [POWER_PAD]  377.19,4.45 0 top